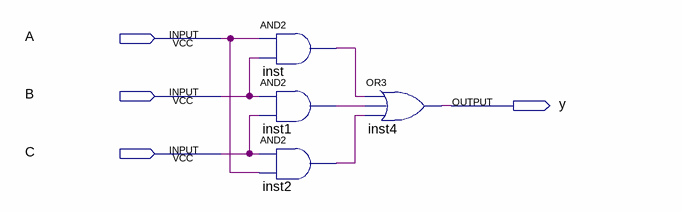
[diagram p0: schematic sheet]
// Quartus schematic majorita3.bdf as structural Verilog: 4 symbols, 4 pins
module majorita3 (
  input  A,
  input  B,
  input  C,
  output y
);

  wire inst1_out, inst2_out, inst_out;

  and inst (inst_out, A, B);
  and inst1 (inst1_out, B, C);
  and inst2 (inst2_out, C, A);
  or inst4 (y, inst_out, inst1_out, inst2_out);
endmodule
